# EAGLE design JunctionBoard (EAGLE 6.6.0)
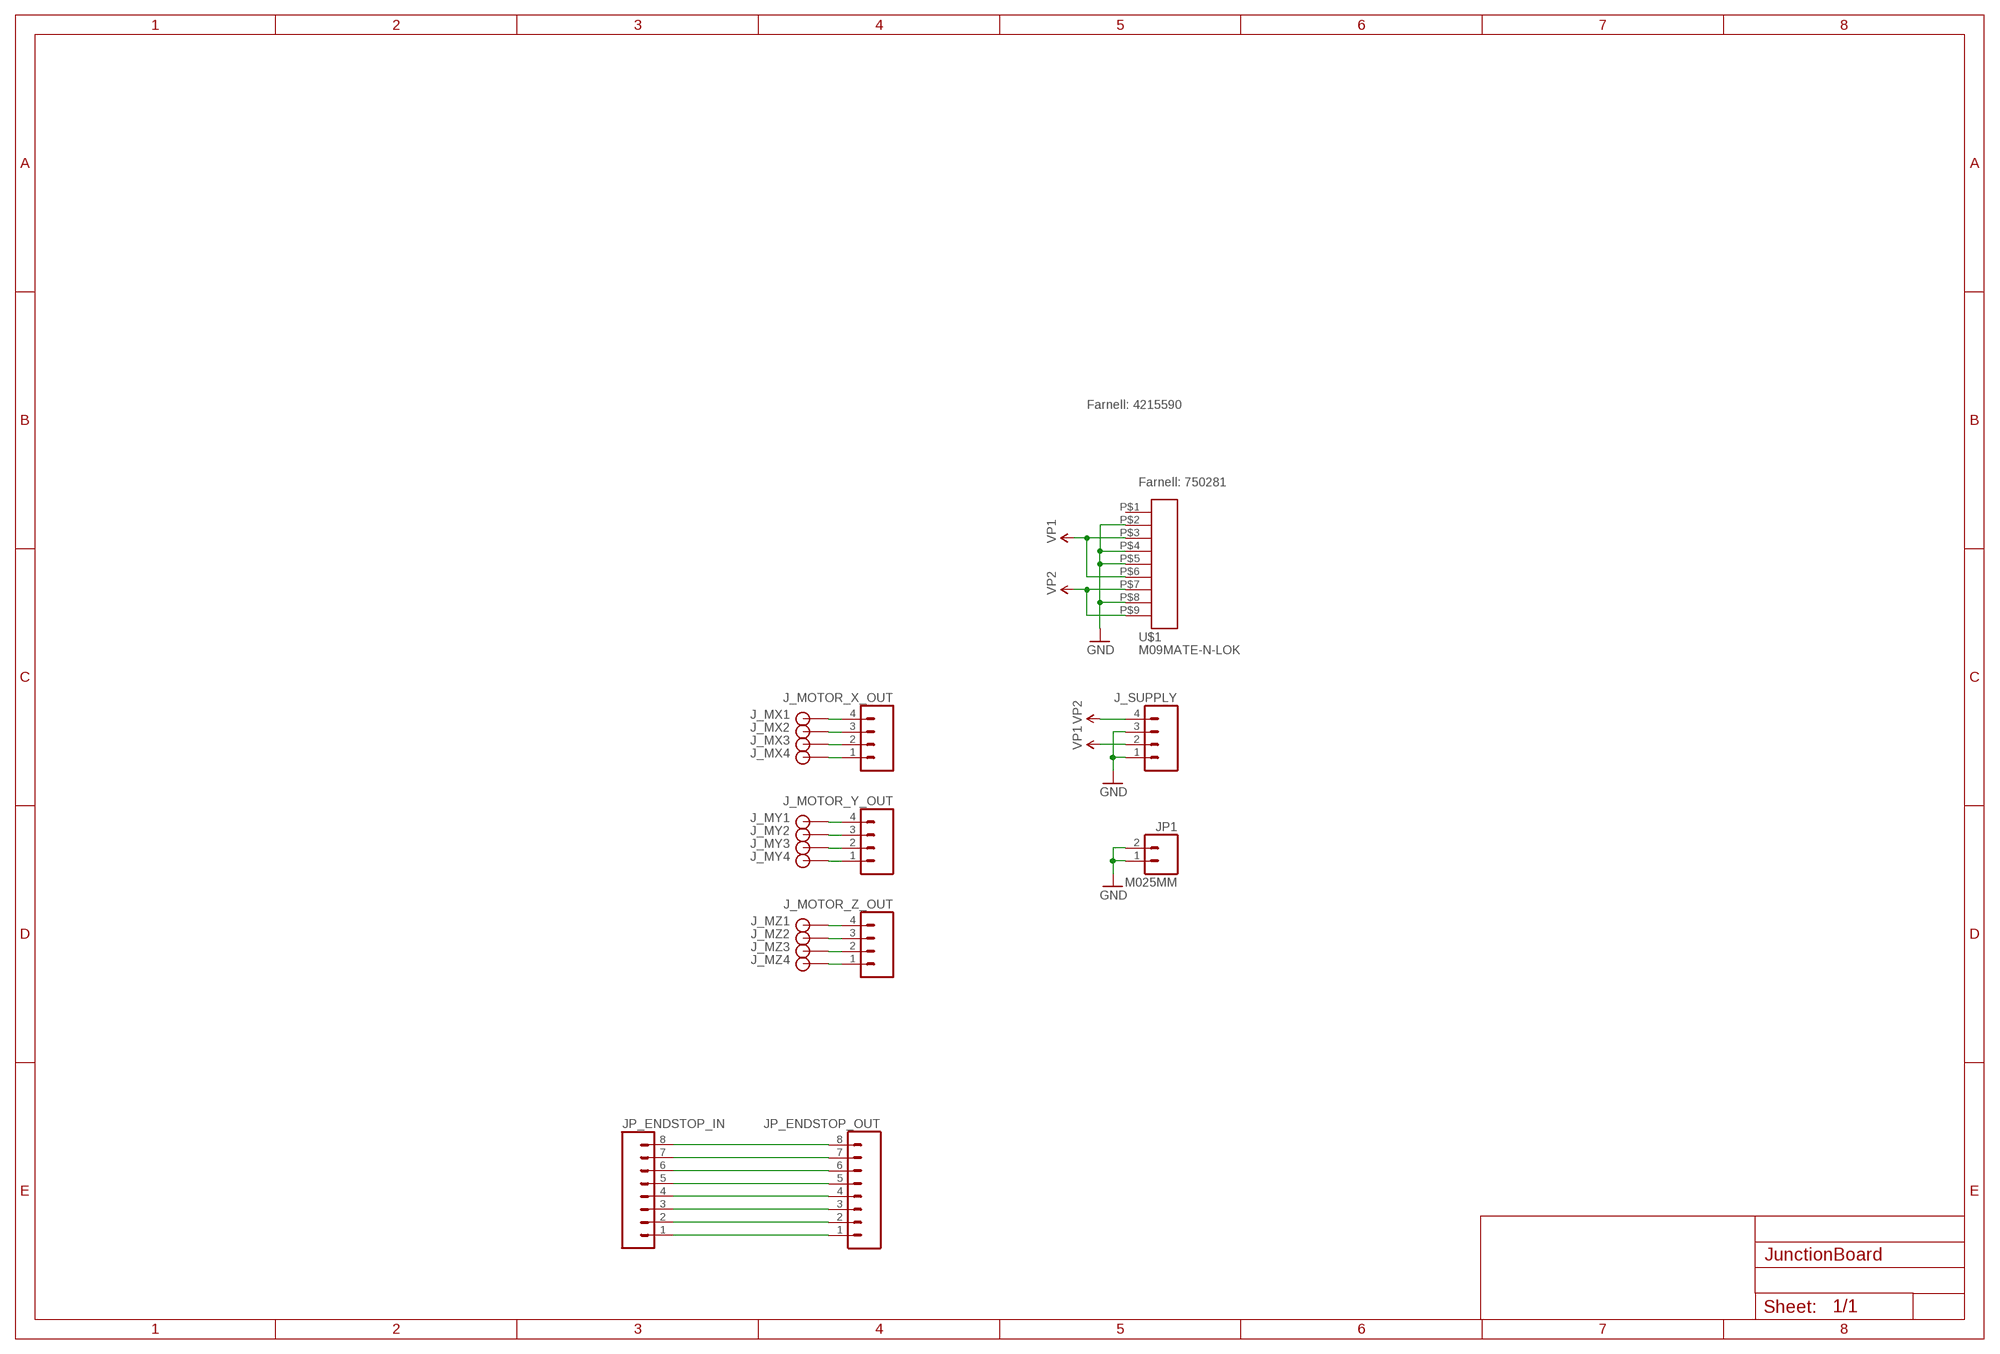
[diagram p0: schematic, sheet 1]

## Parts
J_MOTOR_X_OUT  M04SCREW5  [SCREWTERMINAL-5MM-4]
J_MOTOR_Y_OUT  M04SCREW5  [SCREWTERMINAL-5MM-4]
J_MOTOR_Z_OUT  M04SCREW5  [SCREWTERMINAL-5MM-4]
J_MX1  M01  [FASTON-1]
J_MX2  M01  [FASTON-1]
J_MX3  M01  [FASTON-1]
J_MX4  M01  [FASTON-1]
J_MY1  M01  [FASTON-1]
J_MY2  M01  [FASTON-1]
J_MY3  M01  [FASTON-1]
J_MY4  M01  [FASTON-1]
J_MZ1  M01  [FASTON-1]
J_MZ2  M01  [FASTON-1]
J_MZ3  M01  [FASTON-1]
J_MZ4  M01  [FASTON-1]
J_SUPPLY  M04SCREW5  [SCREWTERMINAL-5MM-4]
JP1  M025MM  [SCREWTERMINAL-5MM-2]
JP_ENDSTOP_IN  M083.5MM-8  [SCREWTERMINAL-3.5MM-8]
JP_ENDSTOP_OUT  M083.5MM-8  [SCREWTERMINAL-3.5MM-8]
U$1  M09MATE-N-LOK  [MATE-N-LOK-9]

## Nets
GND: J_SUPPLY.1 J_SUPPLY.3 JP1.1 JP1.2 U$1.P$2 U$1.P$4 U$1.P$5 U$1.P$8
N$7: J_MOTOR_X_OUT.4 J_MX1.P$1 J_MX1.P$2
N$8: J_MOTOR_X_OUT.3 J_MX2.P$1 J_MX2.P$2
N$9: J_MOTOR_X_OUT.2 J_MX3.P$1 J_MX3.P$2
N$10: J_MOTOR_X_OUT.1 J_MX4.P$1 J_MX4.P$2
N$11: J_MOTOR_Y_OUT.4 J_MY1.P$1 J_MY1.P$2
N$12: J_MOTOR_Y_OUT.3 J_MY2.P$1 J_MY2.P$2
N$13: J_MOTOR_Y_OUT.2 J_MY3.P$1 J_MY3.P$2
N$14: J_MOTOR_Y_OUT.1 J_MY4.P$1 J_MY4.P$2
N$15: J_MOTOR_Z_OUT.4 J_MZ1.P$1 J_MZ1.P$2
N$16: J_MOTOR_Z_OUT.3 J_MZ2.P$1 J_MZ2.P$2
N$17: J_MOTOR_Z_OUT.2 J_MZ3.P$1 J_MZ3.P$2
N$18: J_MOTOR_Z_OUT.1 J_MZ4.P$1 J_MZ4.P$2
N$19: JP_ENDSTOP_IN.1 JP_ENDSTOP_OUT.1
N$20: JP_ENDSTOP_IN.2 JP_ENDSTOP_OUT.2
N$21: JP_ENDSTOP_IN.3 JP_ENDSTOP_OUT.3
N$22: JP_ENDSTOP_IN.4 JP_ENDSTOP_OUT.4
N$23: JP_ENDSTOP_IN.5 JP_ENDSTOP_OUT.5
N$24: JP_ENDSTOP_IN.6 JP_ENDSTOP_OUT.6
N$25: JP_ENDSTOP_IN.7 JP_ENDSTOP_OUT.7
N$26: JP_ENDSTOP_IN.8 JP_ENDSTOP_OUT.8
VP1: J_SUPPLY.2 U$1.P$3 U$1.P$6
VP2: J_SUPPLY.4 U$1.P$7 U$1.P$9
Unconnected: U$1.P$1

## Notes on the sheet
- Farnell: 4215590
- Farnell: 750281

## Library data of the parts
J_MOTOR_X_OUT J_MOTOR_Y_OUT J_MOTOR_Z_OUT J_SUPPLY = 0SBLib:M04: Header 4 Standard 4-pin 0.1" header. Use with straight break away headers (SKU : PRT-00116), right angle break away headers (PRT-00553), swiss pins (PRT-00743), machine pins (PRT-00117), and female headers (PRT-00115). Molex polarized connector foot print use with SKU : PRT-08231 with associated crimp pins and housings. 1MM SMD Version SKU: PRT-10208
J_MX1-J_MX4 J_MY1-J_MY4 J_MZ1-J_MZ4 = 0SBLib:M01
JP1 = SparkFun-Connectors:M02: Standard 2-pin 0.1" header. Use with - straight break away headers ( PRT-00116) - right angle break away headers (PRT-00553) - swiss pins (PRT-00743) - machine pins (PRT-00117) - female headers (PRT-00115) Molex polarized connector foot print use with: PRT-08233 with associated crimp pins and housings. 2.54_SCREWTERM for use with PRT-10571. 3.5mm Screw Terminal footprints for PRT-08084 5mm Screw Terminal footprints for use with PRT-08432; STOREFRONT_ID: PRT-08432
JP_ENDSTOP_IN JP_ENDSTOP_OUT = SparkFun-Connectors:M08: Header 8 Standard 8-pin 0.1" header. Use with straight break away headers (SKU : PRT-00116), right angle break away headers (PRT-00553), swiss pins (PRT-00743), machine pins (PRT-00117), and female headers (PRT-00115).
U$1 = 0SBLib:M09

## Board
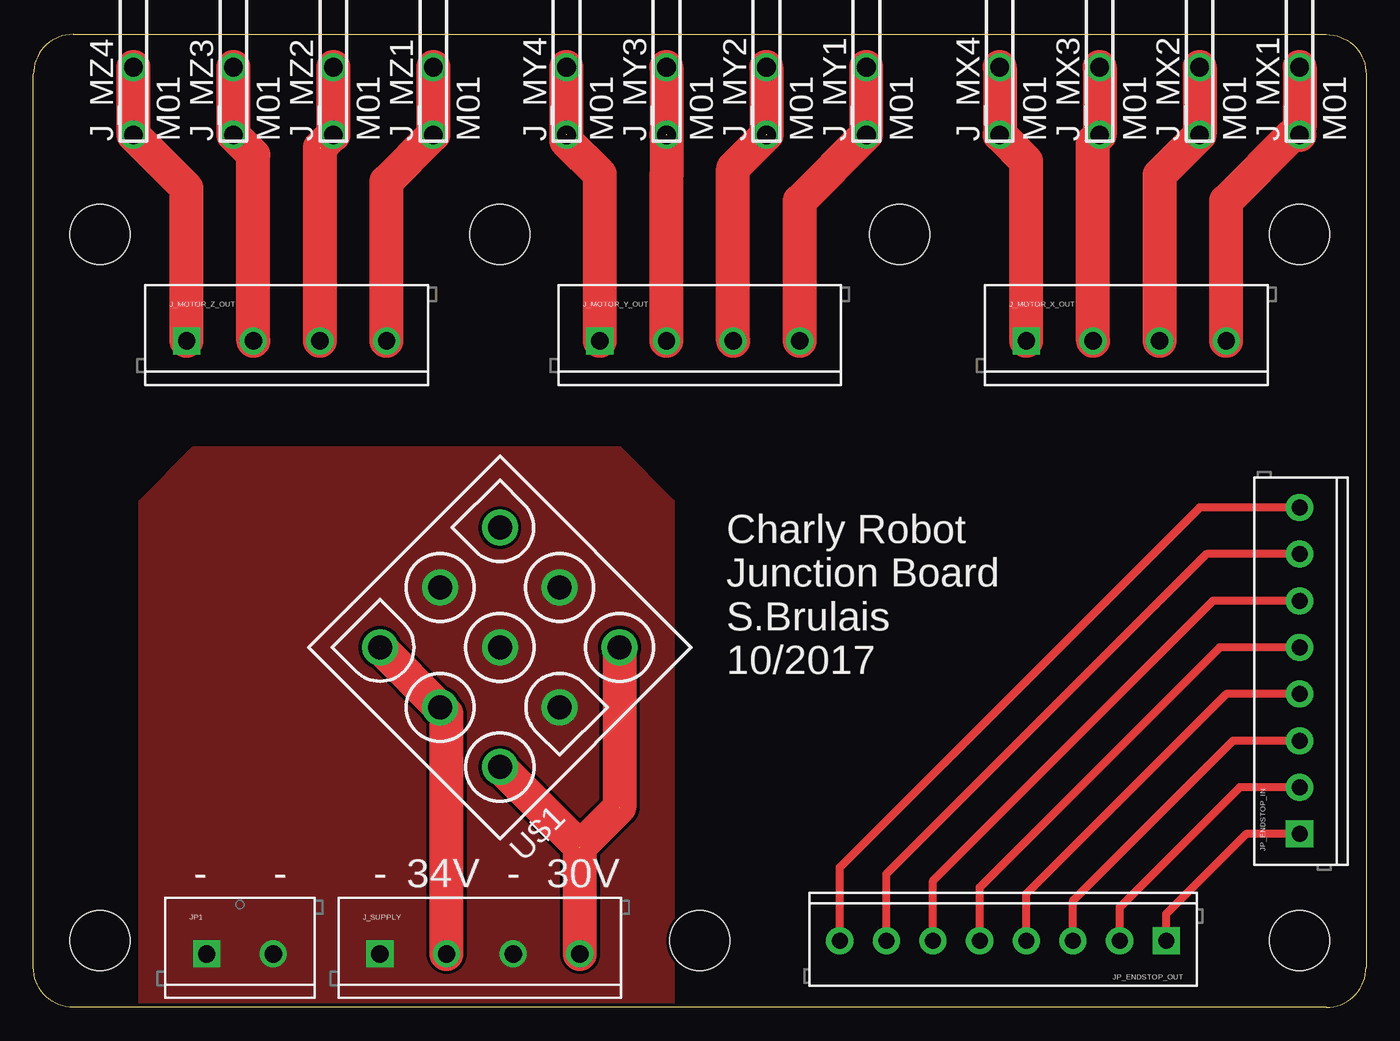
[diagram p1: board, top side]
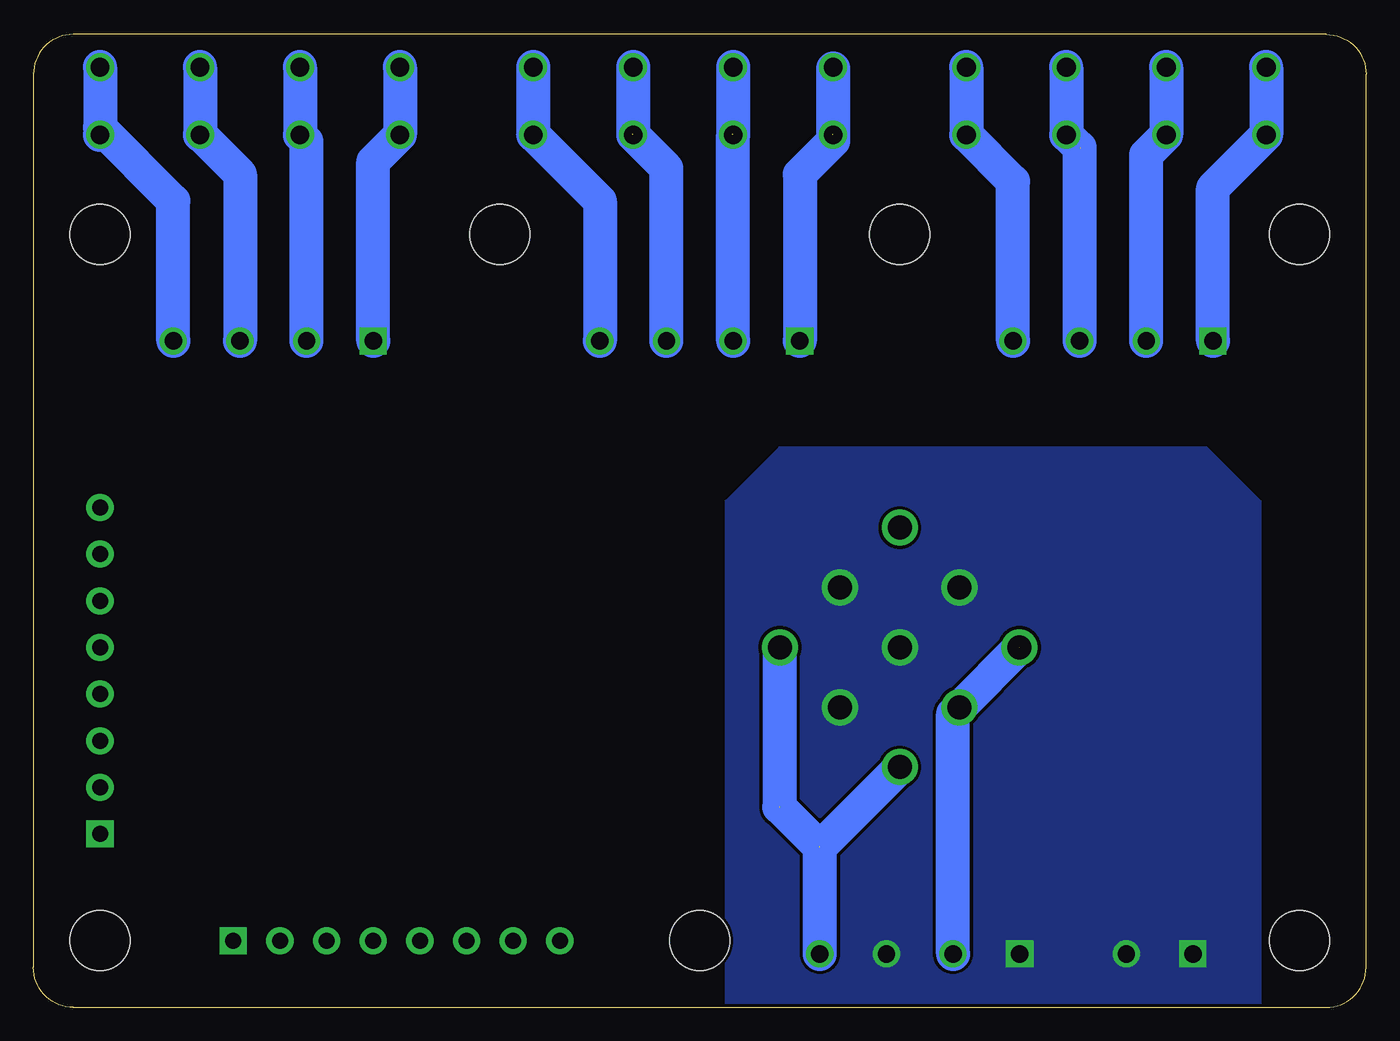
[diagram p2: board, bottom side, seen from below]

Size 100 x 73 mm. Coordinates in mm from the lower left corner, seen from the top.
Outline: 97,0 3,0 arc-90 0,3 0,70 arc-90 3,73 97,73 arc-90 100,70 100,3 arc-90 97,0
Copper layers (1*16): Top 0.035mm / dielectric 1.5mm / Bottom 0.035mm
Design rules "dirt_cheap_dirty_boards.v1": minimum track width 5mil, minimum drill 12mil, track to track 5mil, track to pad 5mil, pad to pad 5mil, via to via 5mil, smd to smd 0mil, copper to edge 10mil, drill to drill 10mil, minimum pad ring 10mil, minimum via ring 6mil, stop-mask expansion 2mil, vias tented up to drill 25mil, thermal gap 10mil
Holes 4.5 mm at 5,5 95,5 50,5 65,58 35,58 5,58 95,58

### Footprints (pad centres in the part's own frame; a part is rotated, then mirrored left to right if it is on the bottom)
SCREWTERMINAL-5MM-4 = drill 1.3 pad 2.032 square: 1 0,0 | drill 1.3 pad 2.032: 2 5,0; 3 10,0; 4 15,0
FASTON-1 = drill 1.4: P$1 0,-2.54; P$2 0,2.54
SCREWTERMINAL-5MM-2 = drill 1.3 pad 2.032 square: 1 0,0 | drill 1.3 pad 2.032: 2 5,0
SCREWTERMINAL-3.5MM-8 = drill 1.2 pad 2.032 square: 1 0,0 | drill 1.2 pad 2.032: 2 3.5,0; 3 7,0; 4 10.5,0; 5 14,0; 6 17.5,0; 7 21,0; 8 24.5,0
MATE-N-LOK-9 = drill 1.8: P$1 6.35,6.35; P$2 0,6.35; P$3 -6.35,6.35; P$4 6.35,0; P$5 0,0; P$6 -6.35,0; P$7 6.35,-6.35; P$8 0,-6.35; P$9 -6.35,-6.35

### Placement (x,y rotation side)
J_MOTOR_X_OUT  74.5,50 0 top
J_MOTOR_Y_OUT  42.5,50 0 top
J_MOTOR_Z_OUT  11.5,50 0 top
J_MX1  95,68 0 top
J_MX2  87.5,68 0 top
J_MX3  80,68 0 top
J_MX4  72.5,68 0 top
J_MY1  62.5,68 0 top
J_MY2  55,68 0 top
J_MY3  47.5,68 0 top
J_MY4  40,68 0 top
J_MZ1  30,68 0 top
J_MZ2  22.5,68 0 top
J_MZ3  15,68 0 top
J_MZ4  7.5,68 0 top
J_SUPPLY  26,4 0 top
JP1  13,4 0 top
JP_ENDSTOP_IN  95,13 90 top
JP_ENDSTOP_OUT  85,5 180 top
U$1  35,27 45 top

### Tracks (layer width: path | path; a pad name or v marks a point on that pad's centre or on a via)
GND
  pour Top (isolate 0.254, no thermals): 8,0 8,38 12,42 44,42 48,38 48,0
  pour Bottom (isolate 0.254, no thermals): 48,0 48,38 44,42 12,42 8,38 8,0
N$7
  Top 2.54: J_MOTOR_X_OUT.4 89.5,60.5 94.5,65.5 94.96,65.5 J_MX1.P$1 | J_MX1.P$2 95,66
  Bottom 2.54: J_MX1.P$2 95,66 | 95,66 J_MX1.P$1 | 95,66 89.5,60.5 J_MOTOR_X_OUT.4
N$8
  Top 2.54: J_MOTOR_X_OUT.3 84.5,62.46 J_MX2.P$1 | J_MX2.P$2 87.5,65.5
  Bottom 2.54: J_MX2.P$2 87.5,65.5 | 87.5,65.5 J_MX2.P$1 | 87.5,65.5 84.5,62.5 J_MOTOR_X_OUT.3
N$9
  Top 2.54: J_MOTOR_X_OUT.2 79.5,64.96 J_MX3.P$1 J_MX3.P$2
  Bottom 2.54: J_MX3.P$2 J_MX3.P$1 79.5,64.96 J_MOTOR_X_OUT.2
N$10
  Top 2.54: J_MOTOR_X_OUT.1 74.5,63.46 J_MX4.P$1 J_MX4.P$2
  Bottom 2.54: J_MX4.P$2 J_MX4.P$1 74.5,63.46 J_MOTOR_X_OUT.1
N$11
  Top 2.54: J_MOTOR_Y_OUT.4 57.5,60.5 62.5,65.5 J_MY1.P$2
  Bottom 2.54: J_MY1.P$2 62.5,65.5 | J_MY1.P$1 62.5,65.5 | 62.5,65.5 57.5,60.5 J_MOTOR_Y_OUT.4
N$12  (1 unrouted)
  Top 2.54: J_MY2.P$2 J_MY2.P$1 | 55.04,65.5 52.54,63 | J_MOTOR_Y_OUT.3 52.5,62.96
  Bottom 2.54: J_MY2.P$2 J_MY2.P$1 52.5,62.96 J_MOTOR_Y_OUT.3
N$13  (1 unrouted)
  Top 2.54: J_MOTOR_Y_OUT.2 47.5,62.46 | 47.54,62.5 47.54,65.5 | J_MY3.P$2 J_MY3.P$1
  Bottom 2.54: J_MOTOR_Y_OUT.2 J_MY3.P$1 J_MY3.P$2
N$14  (1 unrouted)
  Top 2.54: J_MOTOR_Y_OUT.1 42.5,62.5 40,65 J_MY4.P$2
  Bottom 2.54: J_MY4.P$1 40,65 42.5,62.5 J_MOTOR_Y_OUT.1 | 40,70.46 40,65.5
N$15
  Top 2.54: J_MZ1.P$2 J_MZ1.P$1 26.5,61.96 J_MOTOR_Z_OUT.4
  Bottom 2.54: J_MOTOR_Z_OUT.4 26.5,61.96 J_MZ1.P$1 J_MZ1.P$2
N$16  (1 unrouted)
  Top 2.54: J_MZ2.P$2 J_MZ2.P$1 | J_MOTOR_Z_OUT.3 21.5,64.5 22,65
  Bottom 2.54: 21.5,64.46 J_MZ2.P$1 J_MZ2.P$2 | J_MOTOR_Z_OUT.3 21.5,64.5
N$17
  Top 2.54: J_MZ3.P$2 J_MZ3.P$1 16.5,63.96 J_MOTOR_Z_OUT.2
  Bottom 2.54: J_MOTOR_Z_OUT.2 16.5,63.96 J_MZ3.P$1 J_MZ3.P$2
N$18
  Top 2.54: J_MZ4.P$2 J_MZ4.P$1 11.5,61.46 J_MOTOR_Z_OUT.1
  Bottom 2.54: J_MOTOR_Z_OUT.1 11.5,61.46 J_MZ4.P$1 J_MZ4.P$2
N$19
  Top 0.61: JP_ENDSTOP_OUT.1 85,7 91,13 JP_ENDSTOP_IN.1
N$20
  Top 0.61: JP_ENDSTOP_OUT.2 81.5,7.5 90.5,16.5 JP_ENDSTOP_IN.2
N$21
  Top 0.61: JP_ENDSTOP_OUT.3 78,8 90,20 JP_ENDSTOP_IN.3
N$22
  Top 0.61: JP_ENDSTOP_OUT.4 74.5,8.5 89.5,23.5 JP_ENDSTOP_IN.4
N$23
  Top 0.61: JP_ENDSTOP_IN.5 89,27 71,9 JP_ENDSTOP_OUT.5
N$24
  Top 0.61: JP_ENDSTOP_OUT.6 67.5,9.5 88.5,30.5 JP_ENDSTOP_IN.6
N$25
  Top 0.61: JP_ENDSTOP_IN.7 88,34 64,10 JP_ENDSTOP_OUT.7
N$26
  Top 0.61: JP_ENDSTOP_OUT.8 60.5,10.5 87.5,37.5 JP_ENDSTOP_IN.8
VP1  (2 unrouted)
  Top 2.54: J_SUPPLY.2 31,22.02 U$1.P$6 30.49,22.51 26.02,26.98
  Bottom 2.54: J_SUPPLY.2 31,22.02 | 26.02,26.98 30.49,22.51
VP2  (3 unrouted)
  Top 2.54: J_SUPPLY.4 41,12.02 | 41,12.02 U$1.P$9 41,12.02 | U$1.P$7 43.98,15 41,12.02
  Bottom 2.54: J_SUPPLY.4 41,12.02 43.98,15 | 40.98,12 34.98,18 | 44.02,27 44.02,15

### Text on the board
tPlace: -
_tsilk: Charly Robot / Junction Board / S.Brulais / 10/2017 | - | - | - | 34V | - | 30V